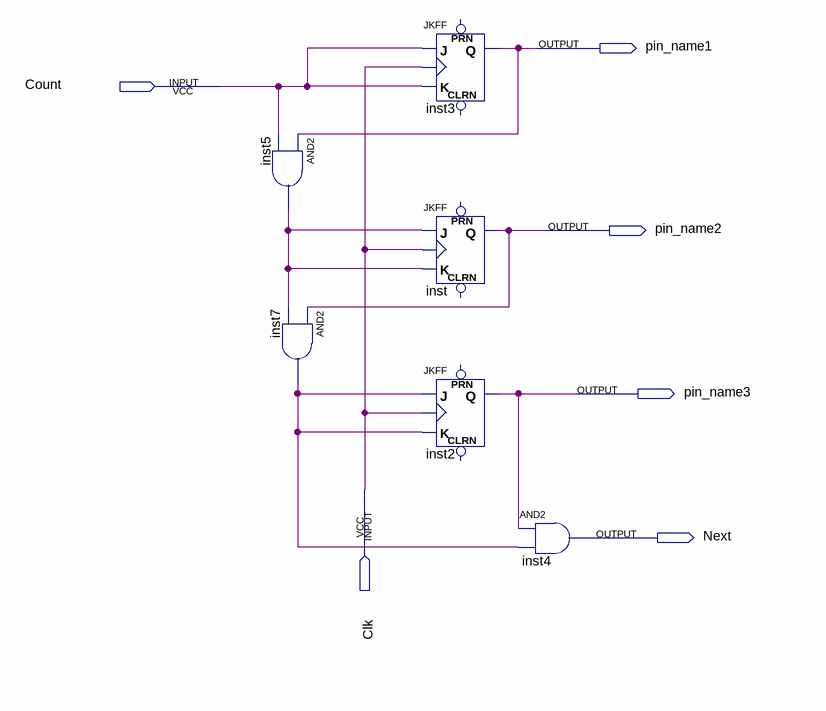
[diagram p0: schematic sheet]
// Quartus schematic JKCount.bdf as structural Verilog: 6 symbols, 6 pins
module JKCount (
  input  Count,
  input  Clk,
  output pin_name1,
  output pin_name2,
  output pin_name3,
  output Next
);

  wire inst5_out, inst7_out;

  and inst5 (inst5_out, pin_name1, Count);
  and inst7 (inst7_out, pin_name2, inst5_out);
  JKFF inst3 (.K(Count), .J(Count), .CLK(Clk), .Q(pin_name1));  // open: PRN, CLRN
  JKFF inst (.K(inst5_out), .J(inst5_out), .CLK(Clk), .Q(pin_name2));  // open: PRN, CLRN
  JKFF inst2 (.K(inst7_out), .J(inst7_out), .CLK(Clk), .Q(pin_name3));  // open: PRN, CLRN
  and inst4 (Next, pin_name3, inst7_out);
endmodule
